# Altium project Zigbee32Bridge.PrjPcb
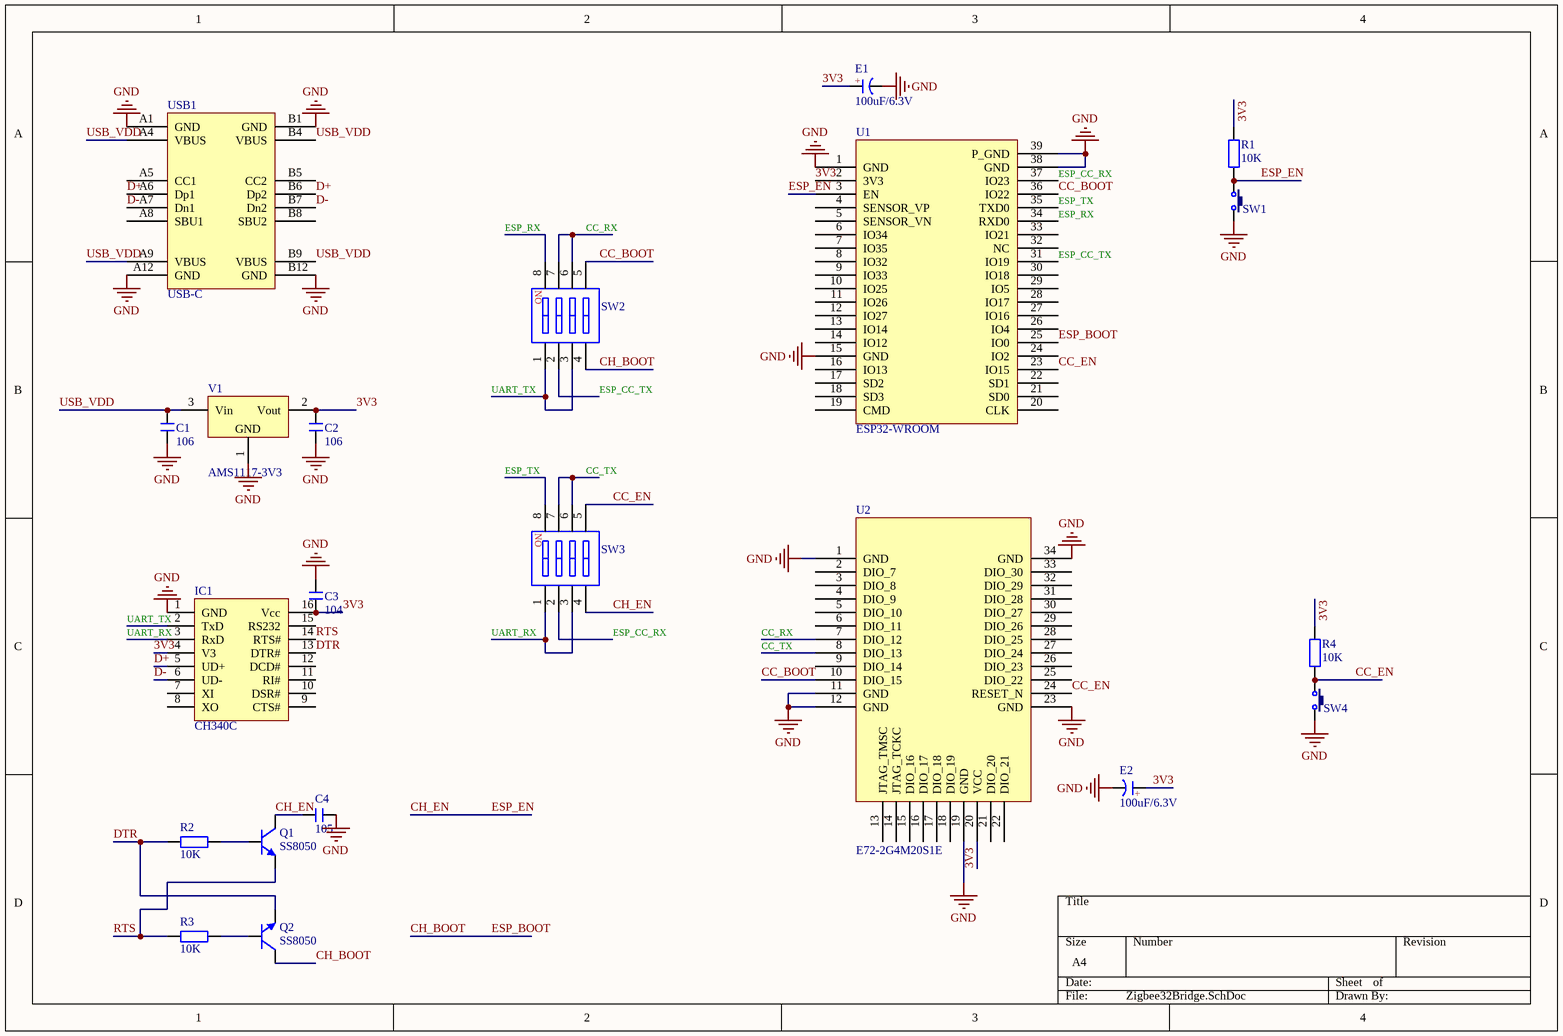
[diagram p0: Zigbee32Bridge.SchDoc]
1 sheet, 21 parts. Net scope: global (net labels, ports and power ports of the same name join across sheets).
Board file: Zigbee32Bridge.PcbDoc

## Sheet Zigbee32Bridge.SchDoc
size A4; SheetNumber: 1; SheetTotal: 1

### Parts
C1  106  [C 0603_L]
C2  106  [C 0603_L]
C3  104  [C 0603_L]
C4  105  [C 0603_L]
E1  100uF/6.3V  [CD A(3216)]
E2  100uF/6.3V  [CD A(3216)]
IC1  CH340C  [SOP16_N]
Q1  SS8050  [SOT23-3N]
Q2  SS8050  [SOT23-3N]
R1  10K  [R 0603_L]
R2  10K  [R 0603_L]
R3  10K  [R 0603_L]
R4  10K  [R 0603_L]
SW1  3x4x5  [TS3x4x2]  (value not drawn)
SW2  CSW-4P  [CSW1.27 SMD-4P]  (value not drawn)
SW3  CSW-4P  [CSW1.27 SMD-4P]  (value not drawn)
SW4  3x4x5  [TS3x4x2]  (value not drawn)
U1  ESP32-WROOM  [ESP32-WROOM]
U2  E72-2G4M20S1E  [RF-BM-2652P2]
USB1  USB-C  [USB Type-C-16Pin_A]
V1  AMS1117-3V3  [SOT223_N]

### Nets
GND: C1.1 C2.1 C3.1 C4.1 E1.2(K) E2.2(K) IC1.1(GND) SW1.2 SW4.2 U1.1(GND) U1.15(GND) U1.38(GND) U1.39(P_GND) U2.1(GND) U2.11(GND) U2.12(GND) U2.19(GND) U2.23(GND) U2.34(GND) USB1.A1(GND) USB1.A12(GND) USB1.B1(GND) USB1.B12(GND) V1.1(GND)
3V3: C2.2 C3.2 E1.1(A) E2.1(A) IC1.4(V3) IC1.16(Vcc) R1.2 R4.2 U1.2(3V3) U2.20(VCC) V1.2(Vout)
CC_BOOT: SW2.5 U1.36(IO22) U2.10(DIO_15)
CC_EN: R4.1 SW3.5 SW4.1 U1.23(IO15) U2.24(RESET_N)
CC_RX: SW2.6 SW2.7 U2.7(DIO_12)
CC_TX: SW3.6 SW3.7 U2.8(DIO_13)
CH_BOOT: Q2.3(C) SW2.4 U1.25(IO0)  [also labelled ESP_BOOT]
CH_EN: C4.2 Q1.3(C) R1.1 SW1.1 SW3.4 U1.3(EN)  [also labelled ESP_EN]
D+: IC1.5(UD+) USB1.A6(Dp1) USB1.B6(Dp2)
D-: IC1.6(UD-) USB1.A7(Dn1) USB1.B7(Dn2)
DTR: IC1.13(DTR#) Q2.2(E) R2.1
ESP_CC_RX: SW3.2 U1.37(IO23)
ESP_CC_TX: SW2.2 U1.31(IO19)
ESP_RX: SW2.8 U1.34(RXD0)
ESP_TX: SW3.8 U1.35(TXD0)
RTS: IC1.14(RTS#) Q1.2(E) R3.1
UART_RX: IC1.3(RxD) SW3.1 SW3.3
UART_TX: IC1.2(TxD) SW2.1 SW2.3
USB_VDD: C1.2 USB1.A4(VBUS) USB1.A9(VBUS) USB1.B4(VBUS) USB1.B9(VBUS) V1.3(Vin)
NetQ1_1: Q1.1(B) R2.2
NetQ2_1: Q2.1(B) R3.2

Not connected (* = marked no-connect by the designer): IC1 7(XI) 8(XO) 9(CTS#) 10(DSR#) 11(RI#) 12(DCD#) 15(RS232); U1 4(SENSOR_VP) 5(SENSOR_VN) 6(IO34) 7(IO35) 8(IO32) 9(IO33) 10(IO25) 11(IO26) 12(IO27) 13(IO14) 14(IO12) 16(IO13) 17(SD2) 18(SD3) 19(CMD) 20(CLK) 21(SD0) 22(SD1) 24(IO2) 26(IO4) 27(IO16) 28(IO17) 29(IO5) 30(IO18) 32(NC) 33(IO21); U2 2(DIO_7) 3(DIO_8) 4(DIO_9) 5(DIO_10) 6(DIO_11) 9(DIO_14) 13(JTAG_TMSC) 14(JTAG_TCKC) 15(DIO_16) 16(DIO_17) 17(DIO_18) 18(DIO_19) 21(DIO_20) 22(DIO_21) 25(DIO_22) 26(DIO_23) 27(DIO_24) 28(DIO_25) 29(DIO_26) 30(DIO_27) 31(DIO_28) 32(DIO_29) 33(DIO_30); USB1 A5(CC1) A8(SBU1) B5(CC2) B8(SBU2)

### Notes on the sheet
- (in symbol C-CD) +
- (in symbol CSW-4P) NO

### Library data of the parts
C1-C4 = C: 无极性贴片电容; 版权归属: 源创客; 材质: X7R; BOM名称: 无极性贴片电容; 学习资源: www.ooocke.com
E1 E2 = C-CD: 贴片钽电容; 版权归属: 源创客; BOM名称: 贴片钽电容; 学习资源: www.ooocke.com
IC1 = CH340G: 串口转USB; 版权归属: 源创客; BOM名称: 串口转USB; 学习资源: www.ooocke.com
Q1 Q2 = 8050-SMD: 高频放大-NPN型; 版权归属: 源创客; 属性: 40V 1.5A 1W 100MHZ; BOM名称: 高频放大-NPN型; 学习资源: www.ooocke.com
R1-R4 = R: 贴片电阻; 版权归属: 源创客; BOM名称: 贴片电阻; 学习资源: www.ooocke.com
SW1 SW4 = TS 3x4: 3x4轻触开关; BOM名称: 3x6轻触开关; 版权归属: 源创客; 学习资源: www.ooocke.com
SW2 SW3 = CSW-4P: 4路编码开关; 版权归属: 源创客; BOM名称: 4路编码开关; 学习资源: www.ooocke.com
USB1 = USB-C-16P: USB-C型母接口; 版权归属: 源创客; BOM名称: USB-C型母接口; 学习资源: www.ooocke.com
V1 = AMS1117: 三端稳压芯片; BOM名称: 稳压芯片; 版权归属: 源创客; 学习资源: www.ooocke.com